# Altium schematic sheet SD-CARD_CN.SchDoc
size A; SheetNumber: 6; SheetTotal: 7
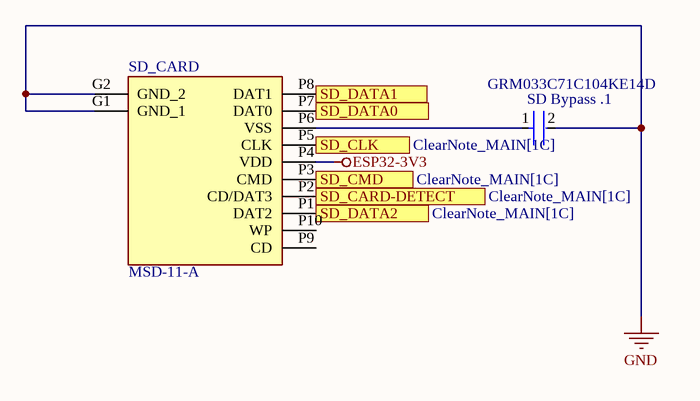
[diagram p0: SD-CARD_CN.SchDoc]

## Parts
SD_Bypass_.1  GRM033C71C104KE14D  [FP-GRM033-0_03-MFG]
SD_CARD  MSD-11-A  [MSD11A]

## Ports
SD_CARD-DETECT (see ClearNote_MAIN[1C]), SD_CLK (see ClearNote_MAIN[1C]), SD_CMD (see ClearNote_MAIN[1C]), SD_DATA0 (see ClearNote_MAIN[1C]), SD_DATA1 (see ClearNote_MAIN[1C]), SD_DATA2 (see ClearNote_MAIN[1C])

## Nets
ESP32-3V3: SD_CARD.P4(VDD)
GND: SD_Bypass_.1.2 SD_CARD.G1(GND_1) SD_CARD.G2(GND_2)
SD_CARD-DETECT: SD_CARD.P2(CD/DAT3) ; port SD_CARD-DETECT
SD_CLK: SD_CARD.P5(CLK) ; port SD_CLK
SD_CMD: SD_CARD.P3(CMD) ; port SD_CMD
SD_DATA0: SD_CARD.P7(DAT0) ; port SD_DATA0
SD_DATA1: SD_CARD.P8(DAT1) ; port SD_DATA1
SD_DATA2: SD_CARD.P1(DAT2) ; port SD_DATA2
NetSD_Bypass_.1_1: SD_Bypass_.1.1 SD_CARD.P6(VSS)

Not connected (* = marked no-connect by the designer): SD_CARD P9(CD) P10(WP)

## Library data of the parts
SD_Bypass_.1 = CMP-06035-019037-1: Chip Multilayer Ceramic Capacitors for General Purpose, 0201, 0.10uF, X7S, 22%, 10%, 16V; Capacitance: 100nF; Dielectric: X7S; Tolerance: 10%; Voltage Rating (DC): 16V; Height: 0.3mm; Max Operating Temperature: 125°C; Case Code (Metric): 0603; Termination: SMD/SMT; Min Operating Temperature: -55°C; Mount: Surface Mount; Case/Package: 0201; Weight: 1.2E-05oz; Package Quantity: 15000; Length: 0.024inch; Voltage Rating: 16V; Case Code (Imperial): 0201; Packaging: Tape and Reel; Thickness: 0.013inch; Width: 0.3mm
SD_CARD = MSD-11-A: Connector; Manufacturer_Name: Same Sky; Datasheet Link: https://www.sameskydevices.com/product/resource/msd-11-a.pdf; Height: 2.05mm; Manufacturer_Part_Number: MSD-11-A; Mouser Part Number: 179-MSD-11-A; Mouser Price/Stock: https://www.mouser.co.uk/ProductDetail/Same-Sky/MSD-11-A?qs=Z%252BL2brAPG1Ik3z2e2QtVog%3D%3D; Arrow Part Number: MSD-11-A; Arrow Price/Stock: https://www.arrow.com/en/products/msd-11-a/cui-devices?region=nac